# Altium schematic sheet Wi_Fi.SchDoc
size 209 x 297 mm; CmpIndex: 90; SymIndex: 29
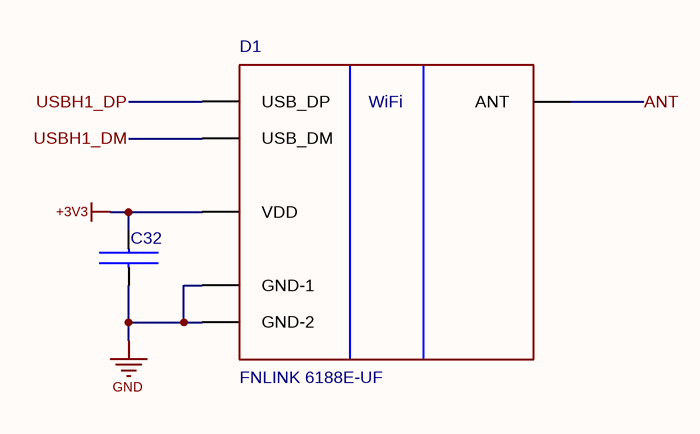
[diagram p0: Wi_Fi.SchDoc]

## Parts
C32  0603-1uF-16V-10%-X7R  (value not drawn)
D1  FNLINK 6188E-UF

## Nets
+3V3: C32.2 D1.3(VDD)
GND: C32.1 D1.1(GND-2) D1.6(GND-1)
ANT: D1.2(ANT)
USBH1_DM: D1.4(USB_DM)
USBH1_DP: D1.5(USB_DP)

## Notes on the sheet
- Лист
- Изм.
- № Докум.
- Подп.
- Дата
- (in symbol FNLINK 6188E-UF) WiFi

## Library data of the parts
C32 = 0603-1uF-16V-10%-X7R: CmpIndex: 33; DXDB_LIBNAME: Capacitors Ceramic SMD; Ref Designator: C32; SymIndex: 25; Tolerance: 10%; Orientation: 1 = 1; Part Label: 0603-1uF-16V-10%-X7R; Part Name: 0603-1uF-16V-10%-X7R; Part Number NP: 0603-1uF-16V-10%-X7R; Part Number: 0603-1uF-16V-10%-X7R
D1 = FNLINK 6188E-UF: CmpIndex: 29; DXDB_LIBNAME: Modules RF; Ref Designator: D1; SymIndex: 43; Orientation: 0 = 0; Part Label: FNLINK 6188E-UF; Part Name: FNLINK 6188E-UF; Part Number NP: FNLINK 6188E-UF; Part Number: FNLINK 6188E-UF